# EAGLE design Geiger_Counter-v0.9b rev2 (EAGLE 5.10)
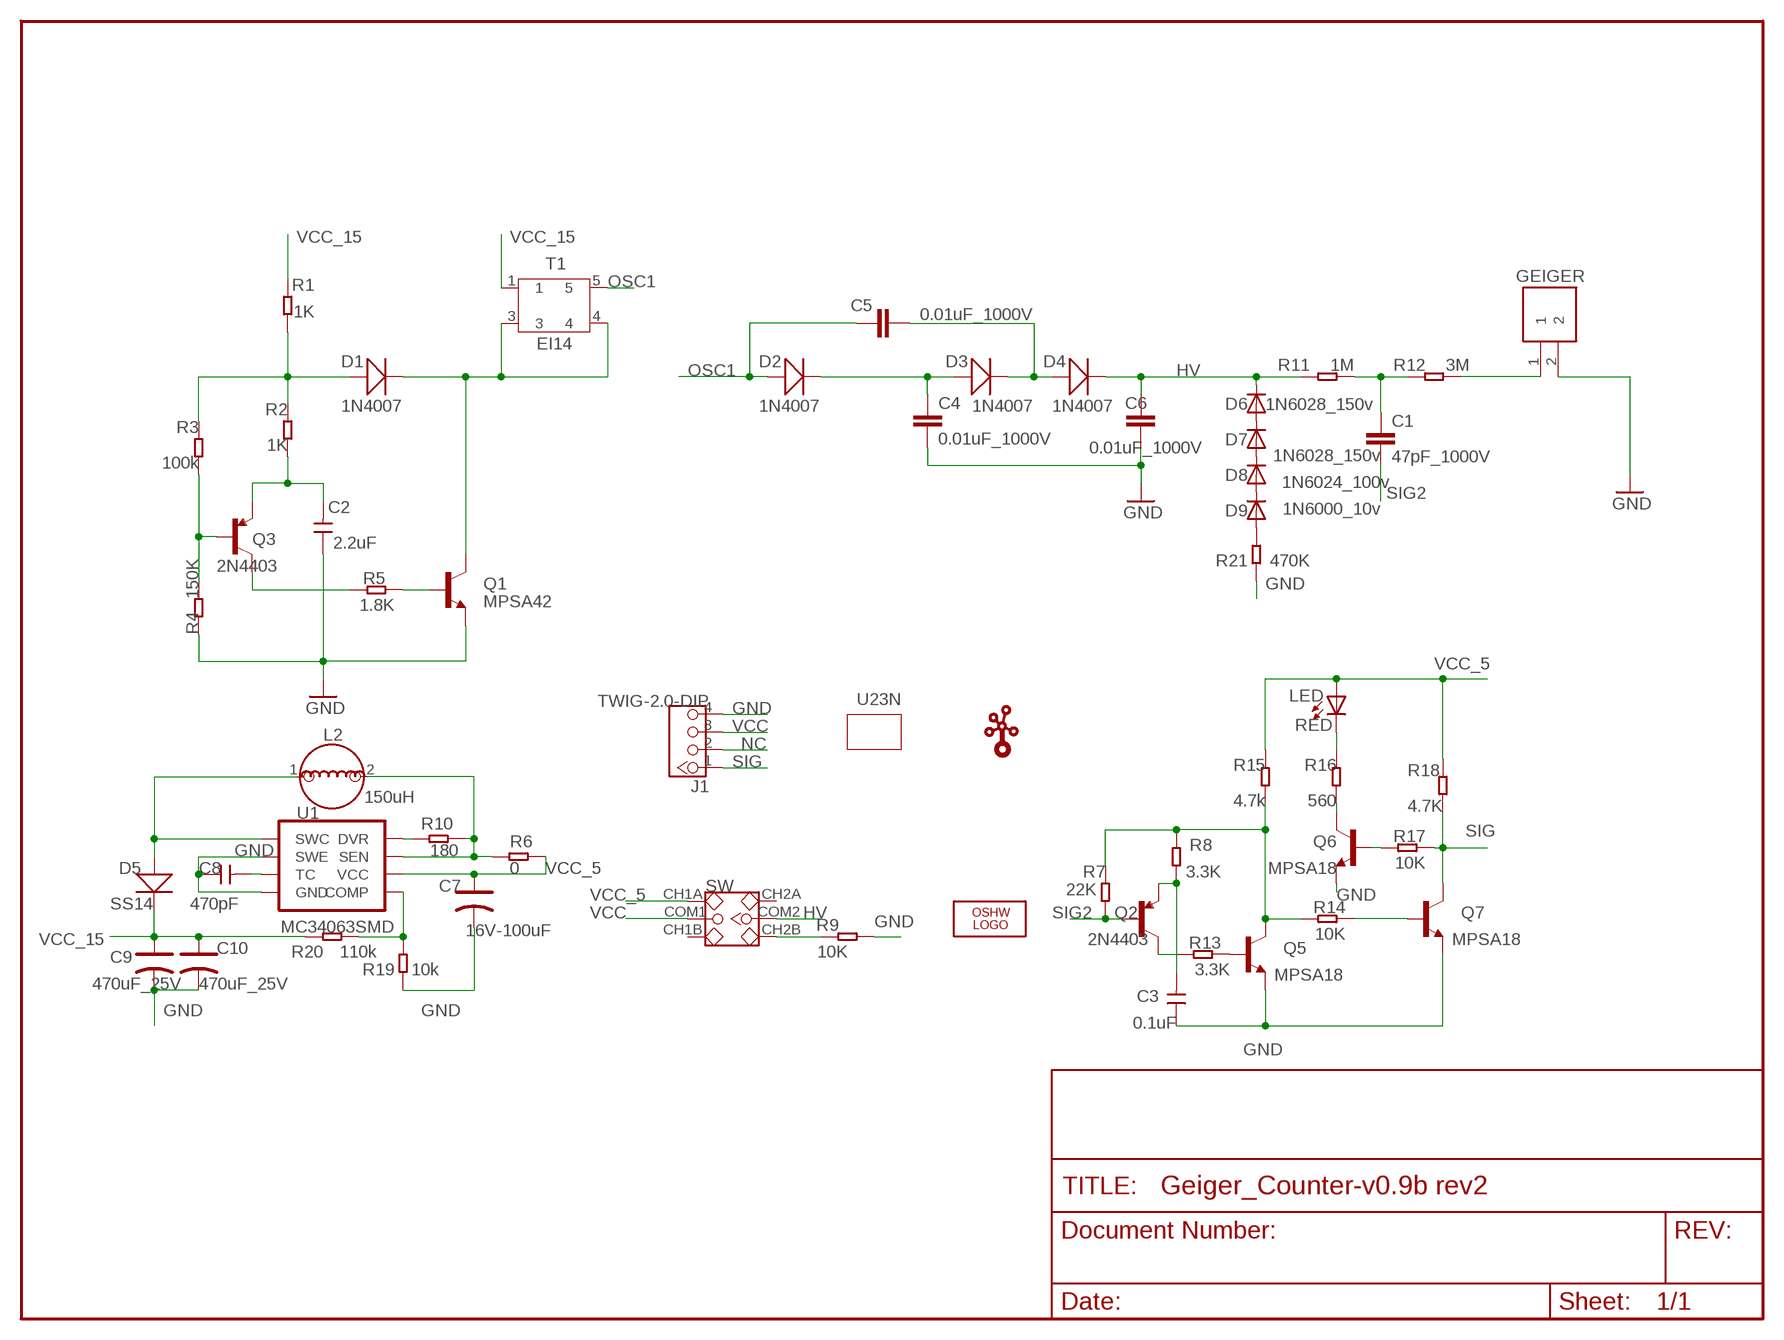
[diagram p0: schematic, sheet 1]

## Parts
C1  47pF_1000V  CAP_  [AXIAL-5MM]
C2  2.2uF  006-C45*60  [0805]
C3  0.1uF  006-C35*35  [0603-1]
C4  0.01uF_1000V  CAPPTH3  [CAP-PTH-LARGE]
C5  0.01uF_1000V  CAPPTH3  [CAP-PTH-LARGE]
C6  0.01uF_1000V  CAPPTH3  [CAP-PTH-LARGE]
C7  16V-100uF  CAP_AVX_C  [AVX_C]
C8  470pF  C-0603  [0603]
C9  470uF_25V  CAP_AVX_D  [AVX_D]
C10  470uF_25V  CAP_AVX_D  [AVX_D]
D1  1N4007  010-D2010  [D2010]
D2  1N4007  010-D2010  [D2010]
D3  1N4007  010-D2010  [D2010]
D4  1N4007  010-D2010  [D2010]
D5  SS14  D-2010  [D2010]
D6  1N6028_150v  004-DIODEPTH2  [DOIDE-1N4148]
D7  1N6028_150v  004-DIODEPTH2  [DOIDE-1N4148]
D8  1N6024_100v  004-DIODEPTH2  [DOIDE-1N4148]
D9  1N6000_10v  004-DIODEPTH2  [DOIDE-1N4148]
GEIGER  CON2  [CON2]
J1  TWIG-2.0-DIP  [2.0_1X4]
L2  150uH  013-L_DIP_CIRCULARINDUCTOR_4MM  [INDUCTOR_4MM]
LED  RED  007-LED3MM  [LED3MM]
LOGO1  LOGO-OSHW-8MILX0500-NT  [OSHW_8X500_NOTEXT]
Q1  MPSA42  TRANSISTOR_NPNSOT23-3  [SOT23-3]
Q2  2N4403  TRANSISTOR_PNPSMD  [SOT23-3]
Q3  2N4403  TRANSISTOR_PNPSMD  [SOT23-3]
Q5  MPSA18  TRANSISTOR_NPNTO92  [TO-92]
Q6  MPSA18  TRANSISTOR_NPNTO92  [TO-92]
Q7  MPSA18  TRANSISTOR_NPNTO92  [TO-92]
R1  1K  005-R0603  [0603-1]
R2  1K  005-R0603  [0603-1]
R3  100k  005-R0603  [0603-1]
R4  150K  005-R0603  [0603-1]
R5  1.8K  005-R0603  [0603-1]
R6  0  R-0603  [0603]
R7  22K  005-R0603  [0603-1]
R8  3.3K  005-R0603  [0603-1]
R9  10K  005-R0603  [0603-1]
R10  180  R-0603  [0603]
R11  1M  R-0603  [0603]
R12  3M  R-0603  [0603]
R13  3.3K  005-R0603  [0603-1]
R14  10K  005-R0603  [0603-1]
R15  4.7k  005-R0603  [0603-1]
R16  560  005-R0603  [0603-1]
R17  10K  005-R0603  [0603-1]
R18  4.7K  005-R0603  [0603-1]
R19  10k  R-0603  [0603]
R20  110k  R-0603  [0603]
R21  470K  R-0603  [0603]
SW  2.54SW_2CH_TH  [2.54SW_2CH]
T1  EI14  EI14-TRANSFORMER  [EI14-TRANSFORMER]
U1  MC34063SMD  [SO08]
U$1  U23N  [U2*3N]
U$2  TWIGLOGO  [TWIGLOGO]

## Nets
GND: C2.1 C3.1 C4.2 C6.2 C7.- C8.1 C9.- C10.- GEIGER.2 J1.4 Q1.2(E) Q5.1(E) Q6.1(E) Q7.1(E) R4.1 R9.1 R19.1 R21.1 U1.2(SWE) U1.4(GND)
HV: C6.1 D4.- D6.C R11.2 SW.COM2
N$1: L2.2 R6.1 R10.2 U1.7(SEN)
N$2: D1.+ R1.1 R2.2 R3.2
N$3: GEIGER.1 R12.1
N$4: C2.2 Q3.2(E) R2.1
N$5: C3.2 Q2.2(E) R8.1
N$6: Q3.3(C) R5.2
N$7: R10.1 U1.8(DVR)
N$8: Q5.3(C) R7.2 R8.2 R14.2 R15.1
N$9: Q1.1(B) R5.1
N$10: D1.- Q1.3(C) T1.3 T1.4
N$11: C4.1 D2.- D3.+
N$12: C5.2 D3.- D4.+
N$13: C1.P$1 R11.1 R12.2
N$14: D5.+ L2.1 U1.1(SWC)
N$15: Q2.3(C) R13.2
N$16: R9.2 SW.CH2B
N$17: Q5.2(B) R13.1
N$18: Q6.2(B) R17.2
N$19: Q6.3(C) R16.1
N$20: Q7.2(B) R14.1
N$21: C8.2 U1.3(TC)
N$22: LED.K(C) R16.2
N$23: D6.A D7.C
N$24: R19.2 R20.1 U1.5(COMP)
N$25: D7.A D8.C
N$26: D8.A D9.C
N$27: D9.A R21.2
NC: J1.2
OSC1: C5.1 D2.+ T1.5
OSC2: Q3.1(B) R3.1 R4.2
SIG: J1.1 Q7.3(C) R17.1 R18.2
SIG2: C1.P$2 Q2.1(B) R7.1
VCC: J1.3 SW.COM1
VCC_5: C7.+ LED.A R6.2 R15.2 R18.1 SW.CH1A U1.6(VCC)
VCC_15: C9.+ C10.+ D5.- R1.2 R20.2 T1.1
Unconnected: SW.CH1B SW.CH2A

## Library data of the parts
C1 C4-C6 = SparkFun:CAP: Capacitor Standard 0603 ceramic capacitor, and 0.1" leaded capacitor.
C2 C3 = Discrete:006-C*: Ceramic Capacitors
C7 C9 C10 = Discrete:CAP*: Electrolytic Capacitors,Tantalum Capacitors and Super Capacitors
C8 = Discrete:C*: Ceramic Capacitors
D1-D4 = Discrete:010-D*
D5 = Discrete:D*
D6-D9 = Discrete:004-DIODE: Diode These are standard reverse protection diodes and small signal diodes. SMA package can handle up to about 1A. SOD-323 can handle about 200mA. What the SOD-323 package when ordering, there are some mfgs out there that are 5-pin packages.
GEIGER = seeedleo:CON2
J1 = Connector:TWIG-2.0-DIP
L2 = Discrete:013-L_DIP_CIRCULAR
LED = Discrete:007-LED: LEDs Standard schematic elements and footprints for 5mm, 3mm, 1206, and 0603 sized LEDs. 5mm - Spark Fun Electronics SKU : COM-00529 (and others)
LOGO1 = Logo:LOGO-OSHW-8MIL
Q1 Q5-Q7 = SparkFun:TRANSISTOR_NPN: Transistor NPN BJT configuration in SOT23 package. MMBT2222 is the common NPN we use. Double check BCE configuration again layout.
Q2 Q3 = SparkFun:TRANSISTOR_PNP
R1-R5 R7-R9 R13-R18 = Discrete:005-R*
R6 R10-R12 R19-R21 = Discrete:R*
SW = CPT_CJ:2.54SW_2CH
T1 = Discrete:EI14-TRANSFORMER
U1 = IC:MC34063
U$1 = twig_template1:U2*3N
U$2 = seeedleo:TWIGLOGO

## Board
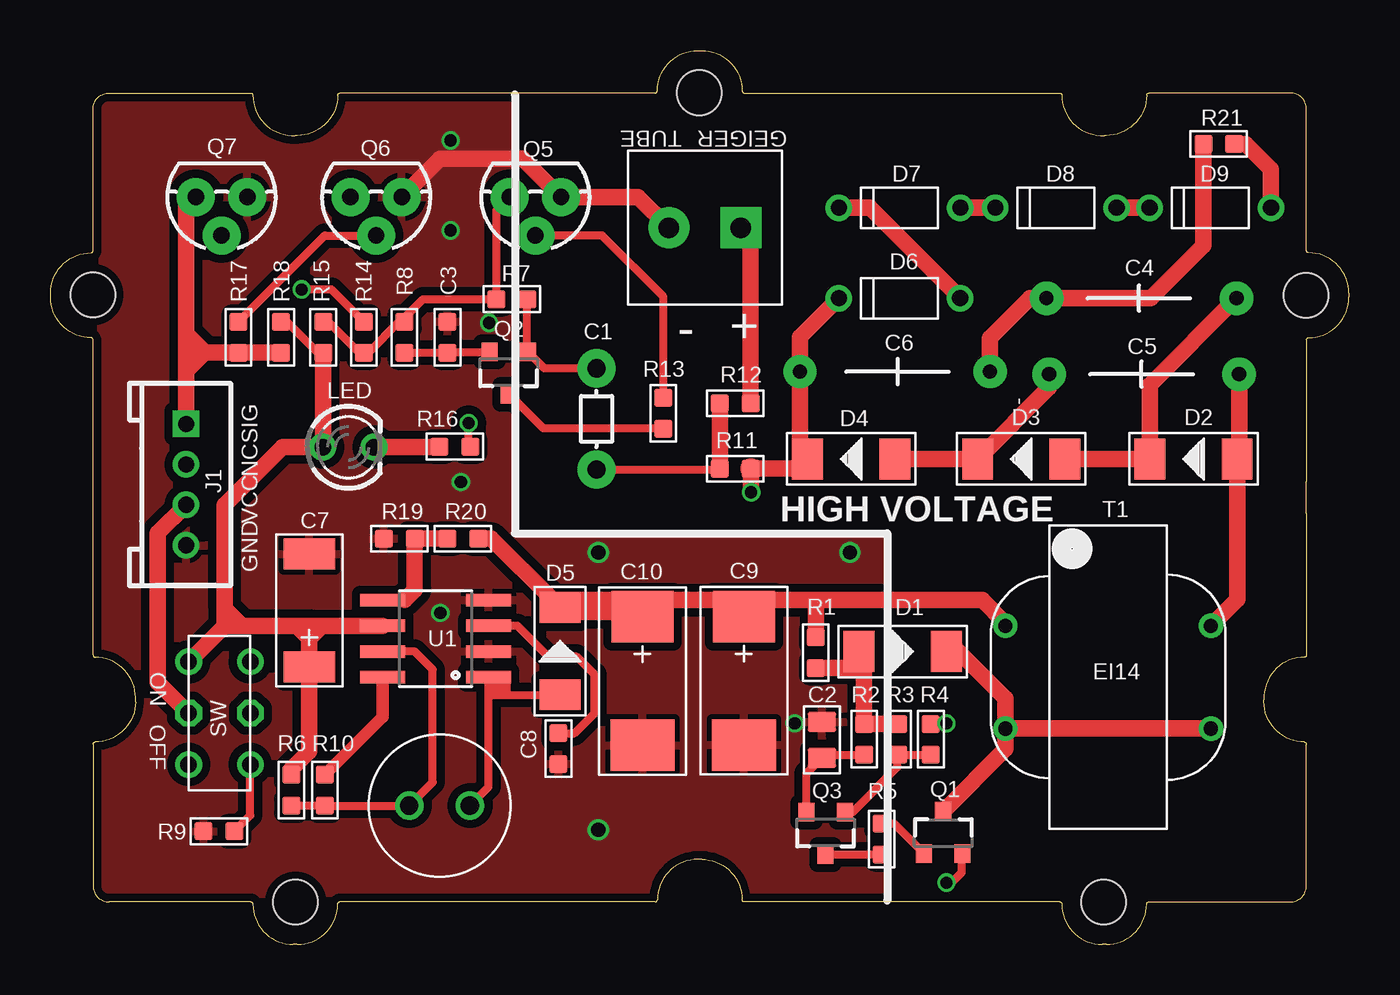
[diagram p1: board, top side]
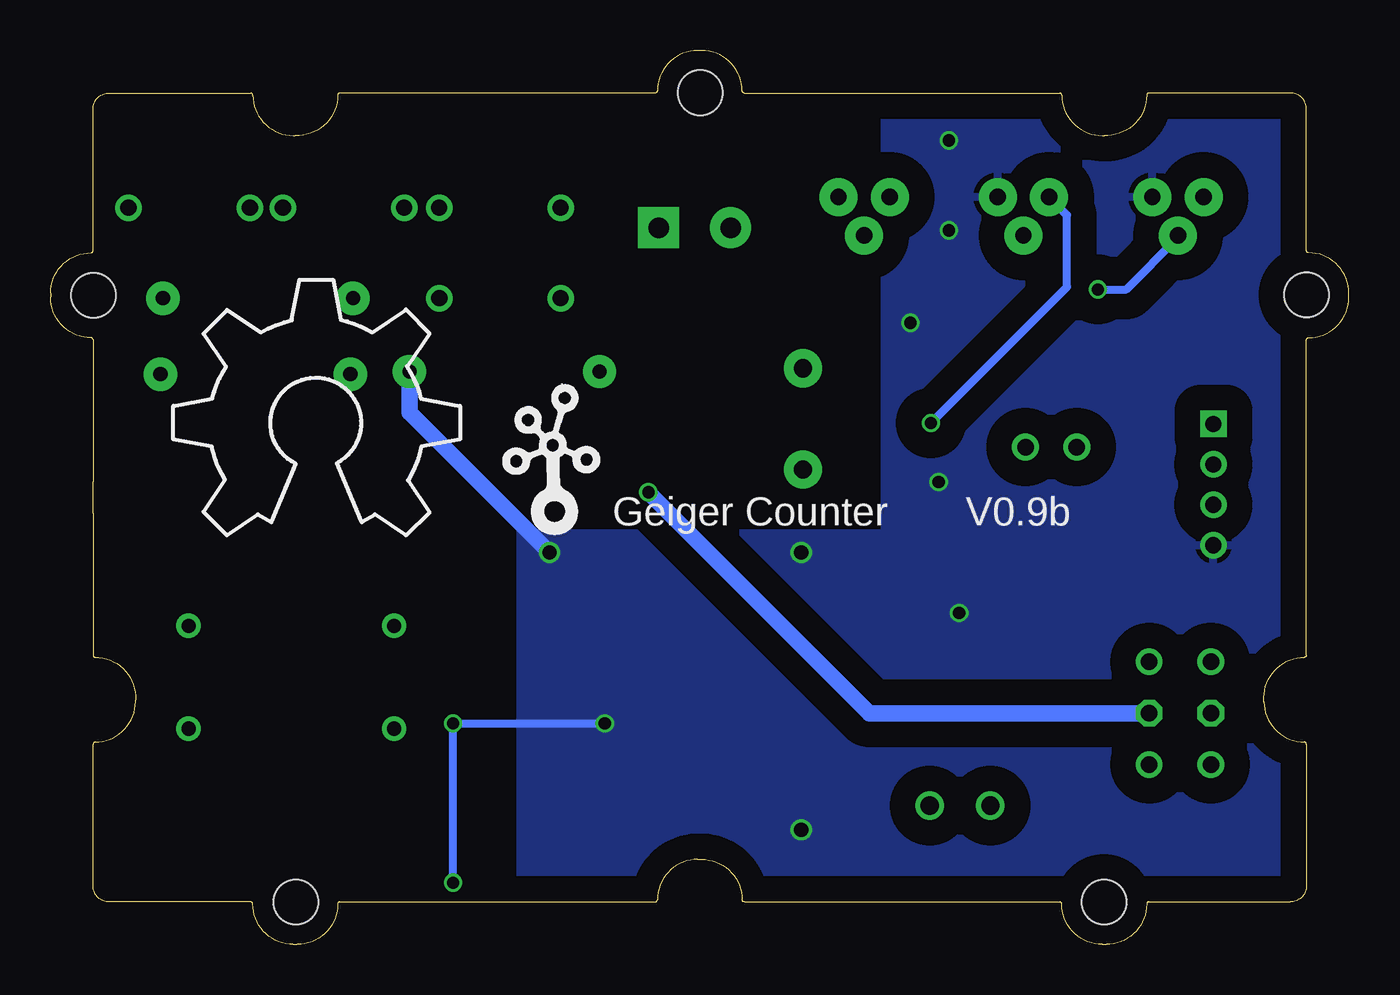
[diagram p2: board, bottom side, seen from below]

Size 64.2 x 44.2 mm. Coordinates in mm from the lower left corner, seen from the top.
Copper layers (1*16): Top 0.035mm / dielectric 1.5mm / Bottom 0.035mm
Design rules "SeeedStudio_rule_no_angle_090911": minimum track width 6mil, minimum drill 12mil, track to track 6mil, track to pad 6mil, pad to pad 6mil, via to via 6mil, smd to smd 0mil, copper to edge 10mil, drill to drill 10mil, minimum pad ring 10mil, minimum via ring 6mil, stop-mask expansion 2mil, vias tented up to drill 100mil, thermal gap 10mil

### Footprints (pad centres in the part's own frame; a part is rotated, then mirrored left to right if it is on the bottom)
AXIAL-5MM = drill 0.9 pad 1.88 round: P$1 -2.5,0; P$2 2.5,0
0805 = smd 1.016 x 1.397: 1 -0.889,0; 2 0.889,0
0603-1 = smd 0.889 x 0.889: 1 -0.762,0; 2 0.762,0
CAP-PTH-LARGE = drill 0.7 pad 1.651 round: 1 -4.826,0; 2 4.572,0
AVX_C = smd 1.524 x 2.54: + -2.794,0; - 2.794,0
0603 = smd 0.889 x 0.889: 1 -0.762,0; 2 0.762,0
AVX_D = smd 2.54 x 3.048: + -3.175,0 | smd 2.54 x 3.175: - 3.175,0
D2010 = smd 1.524 x 2.032: + -2.159,0; - 2.159,0
DOIDE-1N4148 = drill 0.8 round: A 3,0; C -3,0
CON2 = drill 1.016 pad 2.032 square: 1 0,1.778 | drill 1.016 pad 2.032 round: 2 0,-1.778
2.0_1X4 = drill 0.8 pad 1.27 square: 1 -3,0 | drill 0.8 pad 1.27 round: 2 -1,0; 3 1,0; 4 3,0
INDUCTOR_4MM = drill 0.9 round: 1 0,0; 2 3,0
LED3MM = drill 0.813 round: A -1.27,0; K 1.27,0
SOT23-3 = smd 0.8 x 0.9: 1 -0.95,-1; 2 0.95,-1; 3 0,1.1
TO-92 = drill 0.813 pad 1.88 round: 1 -1.27,0; 2 0,1.905; 3 1.27,0
2.54SW_2CH = drill 0.813 pad 1.27 round: CH1A -1.524,2.54; CH1B -1.524,-2.54; CH2A 1.524,2.54; CH2B 1.524,-2.54 | drill 0.813 pad 1.27 octagon: COM1 -1.524,0; COM2 1.524,0
EI14-TRANSFORMER = drill 0.7 pad 1.15 round: 1 2.54,5.08; 3 -2.54,5.08; 4 -2.54,-5.08; 5 2.54,-5.08
SO08 = smd 0.61 x 2.21: 1 -1.905,-2.616; 2 -0.635,-2.616; 3 0.635,-2.616; 4 1.905,-2.616; 5 1.905,2.616; 6 0.635,2.616; 7 -0.635,2.616; 8 -1.905,2.616
U2*3N = hole 2.2: -0.017,20.015; -30.005,10.02; 29.985,9.983; 19.98,-20.005; -19.983,-20.015

### Placement (x,y rotation side)
C1  26.99,25.99 90 top
C2  38.15,10.11 270 top
C3  19.63,30.02 270 top
C4  53.82,31.96 180 top
C5  53.94,28.2 180 top
C6  41.88,28.32 0 top
C7  12.8,16.51 90 top
C8  25.12,9.68 90 top
C9  34.28,13.03 270 top
C10  29.27,13.02 270 top
D1  42.13,14.48 0 top
D2  56.51,24.01 180 top
D3  48,24.01 180 top
D4  39.59,24.01 180 top
D5  25.19,14.51 90 top
D6  41.98,31.96 0 top
D7  41.98,36.43 0 top
D8  49.71,36.43 0 top
D9  57.35,36.43 0 top
GEIGER  32.35,35.44 270 top
J1  6.7,22.73 270 top
L2  20.73,6.86 180 top
LED  14.73,24.59 0 top
LOGO1  58.14,20.2 0 bottom
Q1  44.14,5.49 0 top
Q2  22.65,28.3 180 top
Q3  38.32,5.54 180 top
Q5  23.97,36.96 180 top
Q6  16.1,36.96 180 top
Q7  8.45,36.96 180 top
R1  37.84,14.43 90 top
R2  40.23,10.14 90 top
R3  41.9,10.14 90 top
R4  43.53,10.14 270 top
R5  41.09,5.21 270 top
R6  11.91,7.62 90 top
R7  22.8,31.9 180 top
R8  17.5,30.02 90 top
R9  8.33,5.59 0 top
R10  13.56,7.62 270 top
R11  33.85,23.52 0 top
R12  33.85,26.75 180 top
R13  30.3,26.27 270 top
R14  15.49,30.02 270 top
R15  13.48,30.02 270 top
R16  19.98,24.61 180 top
R17  9.29,30.02 90 top
R18  11.4,30.02 270 top
R19  17.24,20.06 0 top
R20  20.39,20.06 0 top
R21  57.76,39.58 0 top
SW  8.35,11.43 0 top
T1  52.29,13.21 90 top
U1  19.04,15.11 90 top
U$1  32.1,22.1 0 top
U$2  39.34,21.21 0 bottom

### Tracks (layer width: path | path; a pad name or v marks a point on that pad's centre or on a via)
GND  (via drill 0.6, 0.7)
  Top 0.406: R4.1 44.27,10.9 v44.29,10.92 | v44.29,3.05 44.55,3.05 45.05,3.56 45.05,4.07 Q1.2
  Top 0.813: GEIGER.2 29.05,36.96 Q5.1 23.34,38.86 19.27,38.86 Q6.1 | R21.1 57,34.55 54.4,31.95 C4.2 48.43,31.95 46.45,29.97 C6.2
  Top 1.27: 33.89,9.85 C9.-
  Bottom 0.406: v36.8,10.92 v44.29,10.92 v44.29,3.05
  Bottom 0.813: C6.2 46.45,26.31 v39.53,19.38
  other vias: 19.27,16.38 21.69,30.74 19.78,35.31 20.29,22.86 27.08,19.38 27.08,5.66 19.78,39.75
  pour Top (isolate 0.406): 2.26,42.42 22.96,42.42 22.96,20.32 41.37,20.32 41.37,2.03 2.26,2.03
  pour Bottom (isolate 1.27): 2.26,42.42 22.96,42.42 22.96,20.32 40.99,20.32 40.99,2.03 2.26,2.03
HV  (via drill 0.6)
  Top 0.61: 36.95,23.52 D4.-
  Top 0.813: 36.95,23.52 34.64,23.52 v34.64,22.35 | D6.C 37.05,30.03 C6.1 37.05,24.39 D4.-
  Top 1.016: 34.64,23.52 R11.2
  Bottom 0.813: SW.COM2 23.72,11.43 v34.64,22.35
N$1
  Top 0.406: R6.1 R10.2 L2.2 18.89,8.02 18.89,13.59 18,14.48 U1.7
N$2
  Top 0.813: 40.23,13.77 R2.2 R3.2 | 40.23,13.77 40.23,14.23 D1.+ | R1.1 40.13,13.67 40.23,13.77
N$3
  Top 0.813: R12.1 34.62,34.95 GEIGER.1
N$4
  Top 0.406: R2.1 38.3,9.38 C2.2 37.37,8.45 Q3.2
N$5
  Top 0.406: Q2.2 21.7,29.29 19.79,29.29 C3.2 R8.1
N$6
  Top 0.406: Q3.3 R5.2
  Top 0.813: Q3.3
N$7
  Top 0.61: U1.8 16.42,11.25 R10.1
N$8
  Top 0.406: R15.1 13.74,30.79 15.26,29.26 R14.2 15.72,29.26 17.27,30.81 R8.2 17.5,30.99 18.41,31.9 R7.2 22.04,36.3 Q5.3
N$9
  Top 0.406: R5.1 41.71,5.97 Q1.1
N$10
  Top 0.813: T1.3 T1.4 | T1.3 47.21,12.17 44.8,14.58 44.39,14.58 D1.- | T1.3 47.21,9.66 Q1.3
N$11
  Top 0.813: D3.+ D2.- 54.35,27.66 C4.1
N$12
  Top 0.813: D4.+ D3.- 49.37,27.54 C5.2
N$13
  Top 0.406: C1.P$1 33.05,23.49
  Top 0.61: 33.05,23.49 R11.1
  Top 0.813: R11.1 R12.2
N$14
  Top 0.406: 21.65,12.19 21.65,7.78 L2.1 | 21.65,12.19 U1.1 | D5.+ 21.81,12.35 21.65,12.19
N$15
  Top 0.406: Q2.3 22.68,27.2 24.35,25.53 30.2,25.53 30.3,25.43 R13.2
N$16
  Top 0.406: SW.CH2B 9.88,6.38 R9.2
N$17
  Top 0.406: Q5.2 27.27,35.05 30.3,32.03 R13.1
N$18
  Top 0.406: R17.2 13.56,35.05 Q6.2
N$19  (via drill 0.6)
  Top 0.406: v20.67,25.78 20.67,24.69 R16.1
  Bottom 0.406: Q6.3 13.94,36.07 13.94,32.51 v20.67,25.78
N$20  (via drill 0.6)
  Top 0.406: v12.42,32.39 13.89,32.39 R14.1
  Bottom 0.406: Q7.2 8.45,34.95 11.02,32.39 v12.42,32.39
N$21
  Top 0.406: C8.2 25.9,10.44 26.89,11.43 26.89,13.34 26,14.23 24.61,14.23 23.08,15.75 U1.3
N$22
  Top 0.406: 19.2,24.59 R16.2
  Top 0.813: LED.K 19.2,24.59
N$23
  Top 0.813: D7.C 40.51,36.43 D6.A
N$24
  Top 0.61: U1.5 17.5,17.02
  Top 0.813: R20.1 R19.2 18,17.53 17.5,17.02
N$25
  Top 0.813: D7.A D8.C
  Top 1.016: D8.C
N$26
  Top 0.813: D8.A D9.C
  Top 1.016: D9.C
N$27
  Top 0.813: D9.A 60.35,38.33 59.1,39.58 R21.2
N$28
  Top 0.61: 22.07,13.21 22.07,12.57 22.45,12.57 22.45,13.08
OSC1
  Top 0.813: D2.+ 58.64,24.03 | D2.+ 58.67,17.05 T1.5 | C5.1 58.77,24.11 D2.+
OSC2
  Top 0.406: R3.1 R4.2 | Q3.1 39.65,6.54 41.88,8.77 41.88,9.35
  Top 0.813: 41.88,9.35 R3.1
SIG
  Top 0.61: 6.7,30.35 7.84,29.21 | 6.7,28.2 7.84,29.34
  Top 0.813: R18.2 R17.1 6.75,29.26 6.7,29.21 | J1.1 6.7,28.2 6.7,29.21 | 6.7,29.21 6.7,30.35 6.7,36.48 Q7.3
SIG2
  Top 0.406: 23.57,29.33 R7.1 | C1.P$2 24.41,28.49 Q2.1
  Top 0.61: Q2.1 23.57,29.33
VCC
  Top 0.813: SW.COM1 5.3,12.96 5.3,20.34 J1.3
VCC_5
  Top 0.406: R15.2 13.2,29.26 11.68,30.79 R18.1 | 11.91,15.75 12.8,14.86 | 12.8,14.84 13.69,15.73
  Top 0.61: 8.73,15.75 8.61,15.75 | R6.2 11.91,8.66 | 9.62,15.75 8.61,16.77
  Top 0.813: 12.8,15.75 11.91,15.75 9.62,15.75 8.73,15.75 8.61,15.88 8.61,16.77 8.61,21.72 11.48,24.59 LED.A 13.69,24.59 13.48,24.79 R15.2 | 12.8,15.75 U1.6 | 8.61,15.75 SW.CH1A | 12.8,15.75 12.8,14.84 C7.+ 12.8,9.55 11.91,8.66
VCC_15
  Top 0.813: R20.2 21.79,20.06 24.83,17.02 | D5.- 24.83,17.02 | T1.1 47.21,15.88 46.07,17.02 37.82,17.02 | 37.82,17.02 33.37,17.02 33.37,16.21 C9.+ | R1.2 37.84,16.99 37.82,17.02 | 33.64,16.07 33.25,16.76 32.99,17.02 24.83,17.02
  Top 1.27: D5.- 28.29,16.66 C10.+ | 33.64,16.07 C9.+

### Text on the board
tPlace: TUBE | - | + | - | SIG | NC | VCC | HIGH VOLTAGE | GND | ON | OFF
bPlace: V0.9b | Geiger Counter